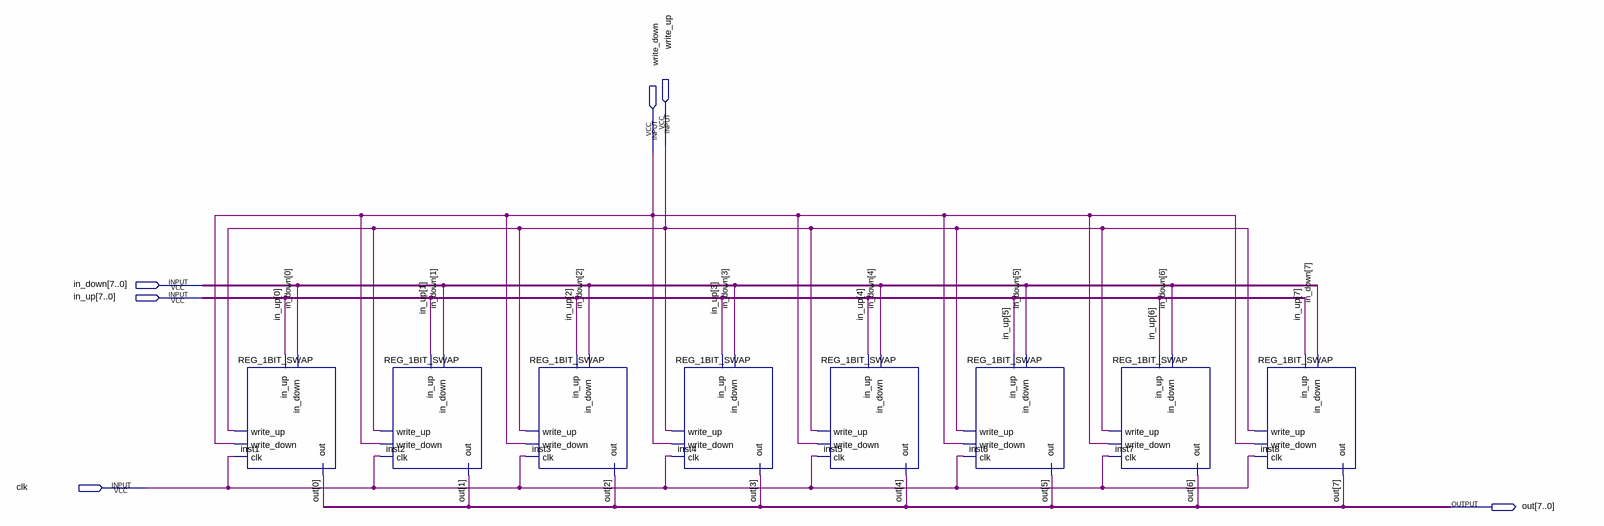
[diagram p0: schematic sheet]
// Quartus schematic REG_1BYTE_SWAP.bdf as structural Verilog: 8 symbols, 6 pins
module REG_1BYTE_SWAP (
  input  write_up,
  input  write_down,
  input  [7:0] in_down,
  input  [7:0] in_up,
  input  clk,
  output [7:0] out
);

  REG_1BIT_SWAP inst1 (
    .write_up(write_up), .in_up(in_up[0]), .write_down(write_down), .in_down(in_down[0]), .clk(clk),
    .out(out[0]));
  REG_1BIT_SWAP inst2 (
    .write_up(write_up), .in_up(in_up[1]), .write_down(write_down), .in_down(in_down[1]), .clk(clk),
    .out(out[1]));
  REG_1BIT_SWAP inst3 (
    .write_up(write_up), .in_up(in_up[2]), .write_down(write_down), .in_down(in_down[2]), .clk(clk),
    .out(out[2]));
  REG_1BIT_SWAP inst4 (
    .write_up(write_up), .in_up(in_up[3]), .write_down(write_down), .in_down(in_down[3]), .clk(clk),
    .out(out[3]));
  REG_1BIT_SWAP inst5 (
    .write_up(write_up), .in_up(in_up[4]), .write_down(write_down), .in_down(in_down[4]), .clk(clk),
    .out(out[4]));
  REG_1BIT_SWAP inst6 (
    .write_up(write_up), .in_up(in_up[5]), .write_down(write_down), .in_down(in_down[5]), .clk(clk),
    .out(out[5]));
  REG_1BIT_SWAP inst7 (
    .write_up(write_up), .in_up(in_up[6]), .write_down(write_down), .in_down(in_down[6]), .clk(clk),
    .out(out[6]));
  REG_1BIT_SWAP inst8 (
    .write_up(write_up), .in_up(in_up[7]), .write_down(write_down), .in_down(in_down[7]), .clk(clk),
    .out(out[7]));
endmodule
